# Altium schematic sheet 200_Ethernet.SchDoc: Ethernet
size A2; SheetNumber: 4; SheetTotal: 7
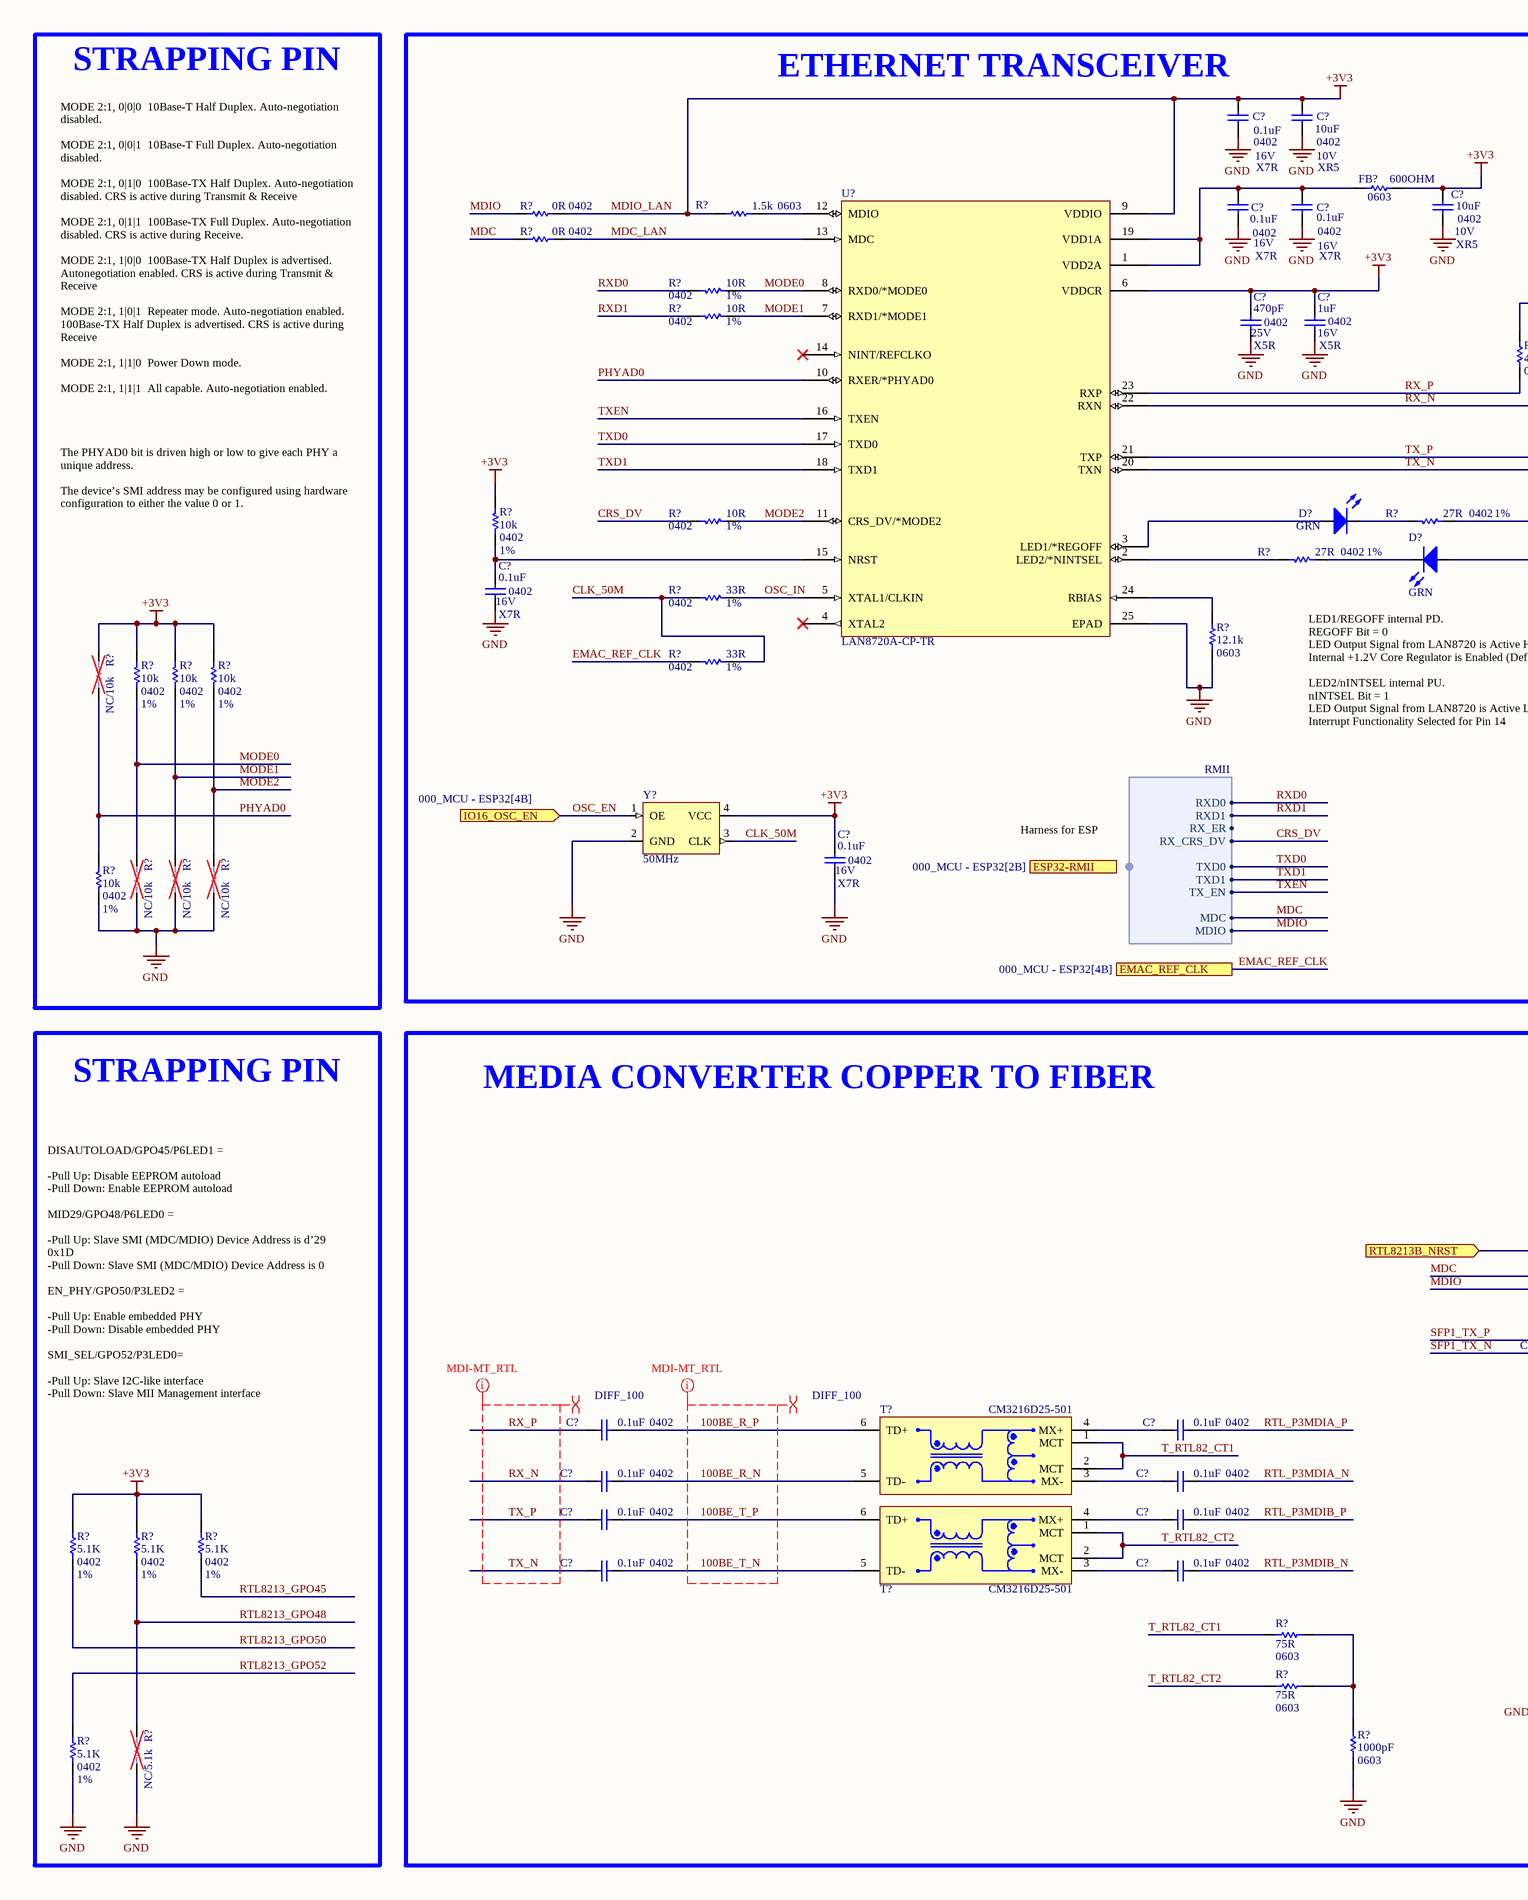
[diagram p0: 200_Ethernet.SchDoc, left]
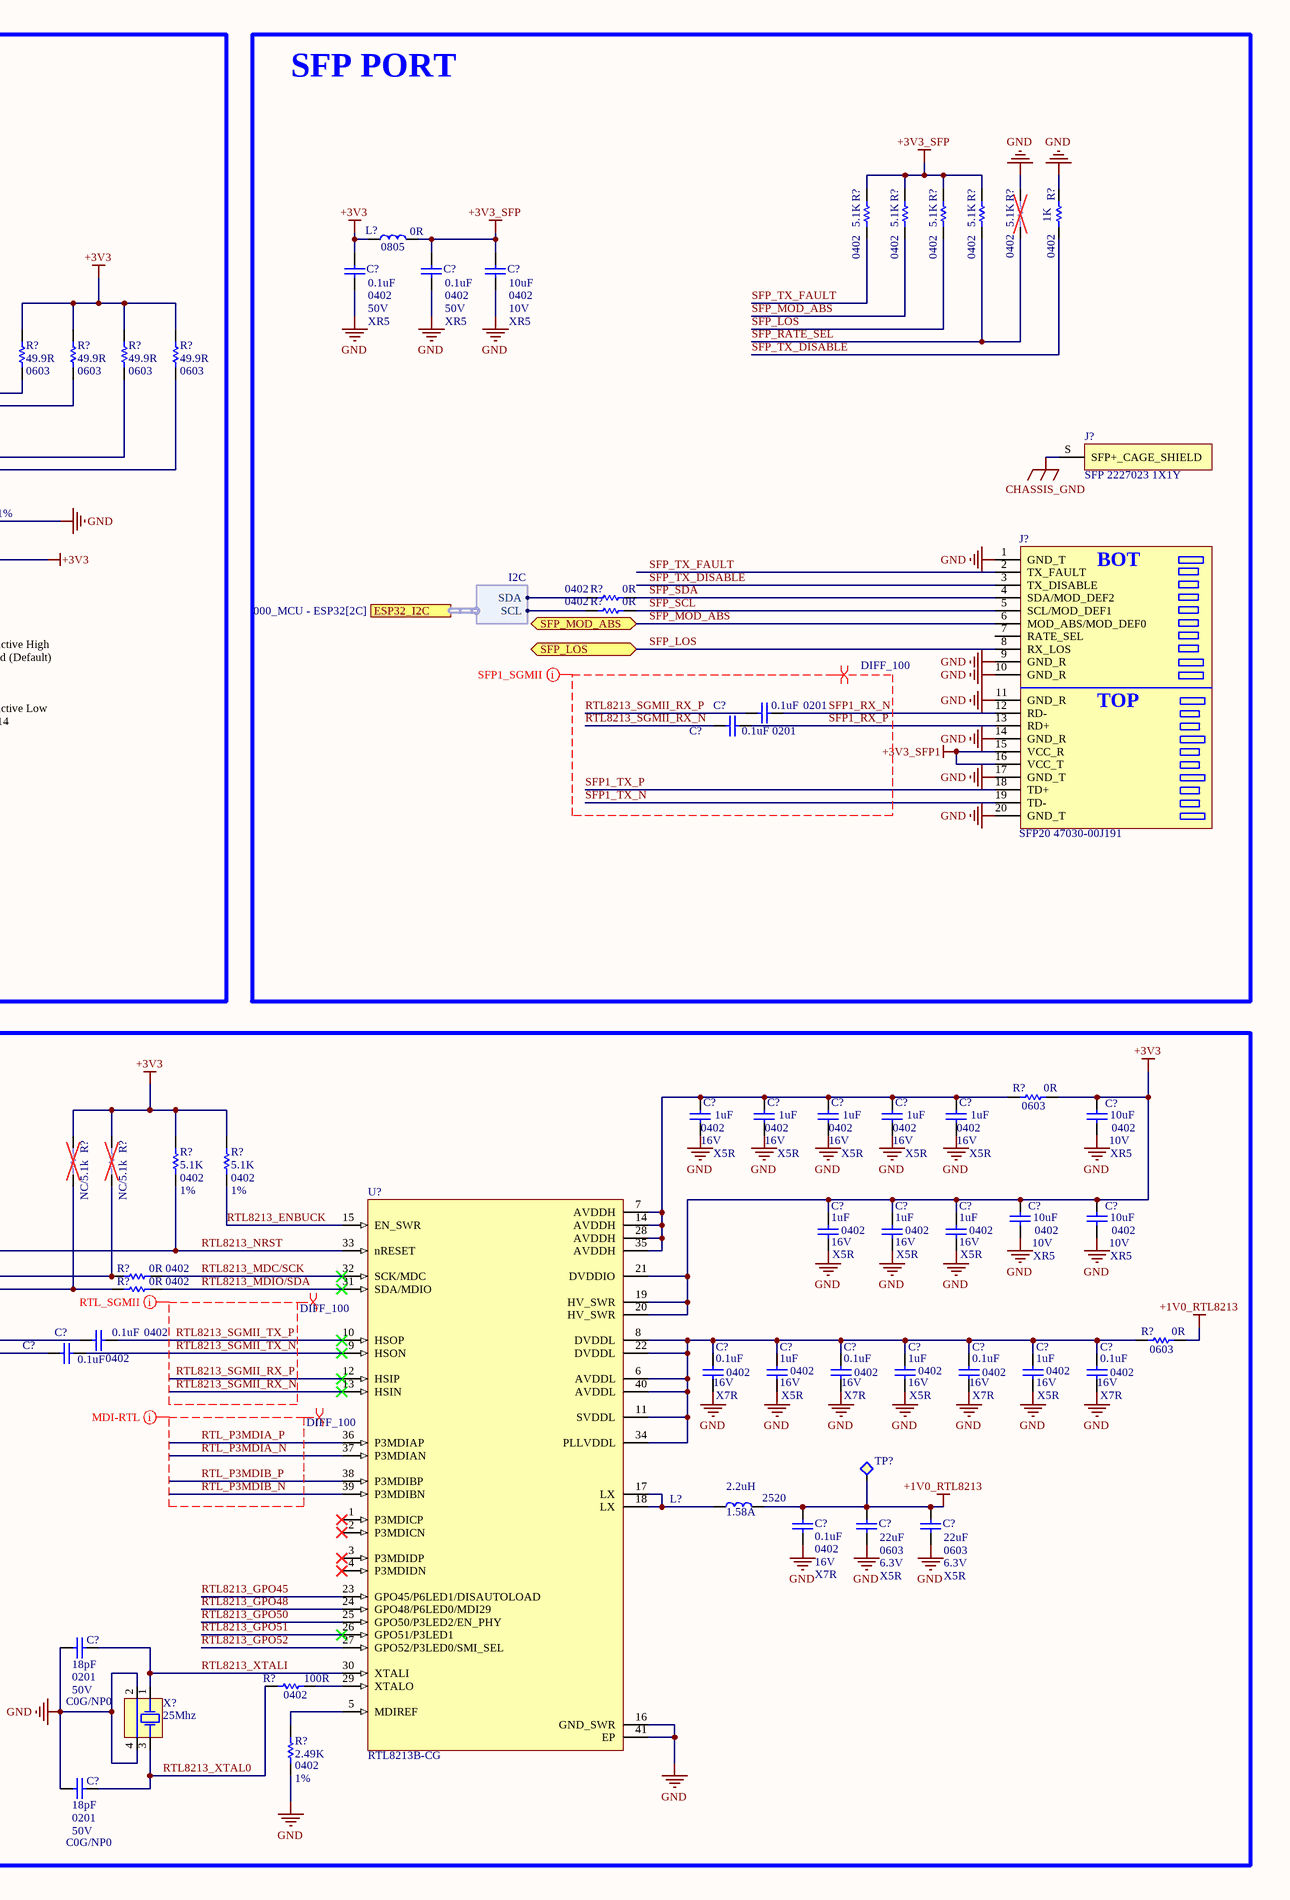
[diagram p1: 200_Ethernet.SchDoc, right]

## Parts
(Parts that share a designator on the sheet are numbered #1, #2 ... from top to bottom, then left to right.)
C?#1  0.1uF  PackageReference: 0402  Voltage: 16V  Temperature Coeficient: X7R  [CAPC1005X03N[0402]]
C?#2  10uF  PackageReference: 0402  Voltage: 10V  Temperature Coeficient: XR5  [CAPC1005X03N[0402]]
C?#3  0.1uF  PackageReference: 0402  Voltage: 16V  Temperature Coeficient: X7R  [CAPC1005X03N[0402]]
C?#4  0.1uF  PackageReference: 0402  Voltage: 16V  Temperature Coeficient: X7R  [CAPC1005X03N[0402]]
C?#5  10uF  PackageReference: 0402  Voltage: 10V  Temperature Coeficient: XR5  [CAPC1005X03N[0402]]
C?#6  0.1uF  PackageReference: 0402  Voltage: 50V  Temperature Coeficient: XR5  [CAPC1005X03N[0402]]
C?#7  0.1uF  PackageReference: 0402  Voltage: 50V  Temperature Coeficient: XR5  [CAPC1005X03N[0402]]
C?#8  10uF  PackageReference: 0402  Voltage: 10V  Temperature Coeficient: XR5  [CAPC1005X03N[0402]]
C?#9  470pF  PackageReference: 0402  Voltage: 25V  Temperature Coeficient: X5R  [CAPC1005X03N[0402]]
C?#10  1uF  PackageReference: 0402  Voltage: 16V  Temperature Coeficient: X5R  [CAPC1005X03N[0402]]
C?#11  0.1uF  PackageReference: 0402  Voltage: 16V  Temperature Coeficient: X7R  [CAPC1005X03N[0402]]
C?#12  0.1uF  PackageReference: 0201  [CAPC0603X04N[0201]]
C?#13  0.1uF  PackageReference: 0201  [CAPC0603X04N[0201]]
C?#14  0.1uF  PackageReference: 0402  Voltage: 16V  Temperature Coeficient: X7R  [CAPC1005X03N[0402]]
C?#15  1uF  PackageReference: 0402  Voltage: 16V  Temperature Coeficient: X5R  [CAPC1005X03N[0402]]
C?#16  1uF  PackageReference: 0402  Voltage: 16V  Temperature Coeficient: X5R  [CAPC1005X03N[0402]]
C?#17  1uF  PackageReference: 0402  Voltage: 16V  Temperature Coeficient: X5R  [CAPC1005X03N[0402]]
C?#18  1uF  PackageReference: 0402  Voltage: 16V  Temperature Coeficient: X5R  [CAPC1005X03N[0402]]
C?#19  1uF  PackageReference: 0402  Voltage: 16V  Temperature Coeficient: X5R  [CAPC1005X03N[0402]]
C?#20  10uF  PackageReference: 0402  Voltage: 10V  Temperature Coeficient: XR5  [CAPC1005X03N[0402]]
C?#21  10uF  PackageReference: 0402  Voltage: 10V  Temperature Coeficient: XR5  [CAPC1005X03N[0402]]
C?#22  10uF  PackageReference: 0402  Voltage: 10V  Temperature Coeficient: XR5  [CAPC1005X03N[0402]]
C?#23  1uF  PackageReference: 0402  Voltage: 16V  Temperature Coeficient: X5R  [CAPC1005X03N[0402]]
C?#24  1uF  PackageReference: 0402  Voltage: 16V  Temperature Coeficient: X5R  [CAPC1005X03N[0402]]
C?#25  1uF  PackageReference: 0402  Voltage: 16V  Temperature Coeficient: X5R  [CAPC1005X03N[0402]]
C?#26  0.1uF  PackageReference: 0402  [CAPC1005X03N[0402]]
C?#27  0.1uF  PackageReference: 0402  [CAPC1005X03N[0402]]
C?#28  0.1uF  PackageReference: 0402  Voltage: 16V  Temperature Coeficient: X7R  [CAPC1005X03N[0402]]
C?#29  1uF  PackageReference: 0402  Voltage: 16V  Temperature Coeficient: X5R  [CAPC1005X03N[0402]]
C?#30  0.1uF  PackageReference: 0402  Voltage: 16V  Temperature Coeficient: X7R  [CAPC1005X03N[0402]]
C?#31  1uF  PackageReference: 0402  Voltage: 16V  Temperature Coeficient: X5R  [CAPC1005X03N[0402]]
C?#32  0.1uF  PackageReference: 0402  Voltage: 16V  Temperature Coeficient: X7R  [CAPC1005X03N[0402]]
C?#33  1uF  PackageReference: 0402  Voltage: 16V  Temperature Coeficient: X5R  [CAPC1005X03N[0402]]
C?#34  0.1uF  PackageReference: 0402  Voltage: 16V  Temperature Coeficient: X7R  [CAPC1005X03N[0402]]
C?#35  0.1uF  PackageReference: 0402  [CAPC1005X03N[0402]]
C?#36  0.1uF  PackageReference: 0402  [CAPC1005X03N[0402]]
C?#37  0.1uF  PackageReference: 0402  [CAPC1005X03N[0402]]
C?#38  0.1uF  PackageReference: 0402  [CAPC1005X03N[0402]]
C?#39  0.1uF  PackageReference: 0402  [CAPC1005X03N[0402]]
C?#40  0.1uF  PackageReference: 0402  [CAPC1005X03N[0402]]
C?#41  0.1uF  PackageReference: 0402  Voltage: 16V  Temperature Coeficient: X7R  [CAPC1005X03N[0402]]
C?#42  22uF  PackageReference: 0603  Voltage: 6.3V  Temperature Coeficient: X5R  [CAPC1608X05N[0603]]
C?#43  22uF  PackageReference: 0603  Voltage: 6.3V  Temperature Coeficient: X5R  [CAPC1608X05N[0603]]
C?#44  0.1uF  PackageReference: 0402  [CAPC1005X03N[0402]]
C?#45  0.1uF  PackageReference: 0402  [CAPC1005X03N[0402]]
C?#46  18pF  PackageReference: 0201  Voltage: 50V  Temperature Coefficient: C0G/NP0  [CAPC0603X04N[0201]]
C?#47  18pF  PackageReference: 0201  Voltage: 50V  Temperature Coefficient: C0G/NP0  [CAPC0603X04N[0201]]
D?#1  GRN  [LED1608L(0603)]
D?#2  GRN  [LED1608L(0603)]
FB?  600OHM  PackageReference: 0603  [RESC1608X05N[0603]]
J?#1  SFP 2227023 1X1Y  [AMPHENOL_U77A16182001]
J?#2  SFP20 47030-00J191  [AMPHENOL_UE76A202000T]
L?#1  0R  PackageReference: 0805  [INDC2012X05N[0805]]
L?#2  2.2uH  PackageReference: 2520  Current: 1.58A  [INDP2520X10N[2510]-TDK]
R?#1  0R  PackageReference: 0402  [RESC1005X03N[0402]]
R?#2  1.5k  PackageReference: 0603  [RESC1608X05N[0603]]
R?#3  5.1K  PackageReference: 0402  [RESC1005X03N[0402]]
R?#4  5.1K  PackageReference: 0402  [RESC1005X03N[0402]]
R?#5  5.1K  PackageReference: 0402  [RESC1005X03N[0402]]
R?#6  5.1K  PackageReference: 0402  [RESC1005X03N[0402]]
R?#7  5.1K  PackageReference: 0402  [RESC1005X03N[0402]]
R?#8  1K  PackageReference: 0402  [RESC1005X03N[0402]]
R?#9  0R  PackageReference: 0402  [RESC1005X03N[0402]]
R?#10  10R  PackageReference: 0402  Tolerance: 1%  [RESC1005X03N[0402]]
R?#11  10R  PackageReference: 0402  Tolerance: 1%  [RESC1005X03N[0402]]
R?#12  49.9R  PackageReference: 0603  [RESC1608X05N[0603]]
R?#13  49.9R  PackageReference: 0603  [RESC1608X05N[0603]]
R?#14  49.9R  PackageReference: 0603  [RESC1608X05N[0603]]
R?#15  49.9R  PackageReference: 0603  [RESC1608X05N[0603]]
R?#16  10k  PackageReference: 0402  Tolerance: 1%  [RESC1005X03N[0402]]
R?#17  10R  PackageReference: 0402  Tolerance: 1%  [RESC1005X03N[0402]]
R?#18  27R  PackageReference: 0402  Tolerance: 1%  [RESC1005X03N[0402]]
R?#19  27R  PackageReference: 0402  Tolerance: 1%  [RESC1005X03N[0402]]
R?#20  33R  PackageReference: 0402  Tolerance: 1%  [RESC1005X03N[0402]]
R?#21  0R  PackageReference: 0402  [RESC1005X03N[0402]]
R?#22  0R  PackageReference: 0402  [RESC1005X03N[0402]]
R?#23  12.1k  PackageReference: 0603  [RESC1608X05N[0603]]
R?#24  33R  PackageReference: 0402  Tolerance: 1%  [RESC1005X03N[0402]]
R?#25  NC/10k  [RESC1005X03N[0402]]
R?#26  10k  PackageReference: 0402  Tolerance: 1%  [RESC1005X03N[0402]]
R?#27  10k  PackageReference: 0402  Tolerance: 1%  [RESC1005X03N[0402]]
R?#28  10k  PackageReference: 0402  Tolerance: 1%  [RESC1005X03N[0402]]
R?#29  10k  PackageReference: 0402  Tolerance: 1%  [RESC1005X03N[0402]]
R?#30  NC/10k  [RESC1005X03N[0402]]
R?#31  NC/10k  [RESC1005X03N[0402]]
R?#32  NC/10k  [RESC1005X03N[0402]]
R?#33  0R  PackageReference: 0603  [RESC1608X05N[0603]]
R?#34  NC/5.1k  [RESC1005X03N[0402]]
R?#35  NC/5.1k  [RESC1005X03N[0402]]
R?#36  5.1K  PackageReference: 0402  Tolerance: 1%  [RESC1005X03N[0402]]
R?#37  5.1K  PackageReference: 0402  Tolerance: 1%  [RESC1005X03N[0402]]
R?#38  0R  PackageReference: 0402  [RESC1005X03N[0402]]
R?#39  0R  PackageReference: 0402  [RESC1005X03N[0402]]
R?#40  0R  PackageReference: 0603  [RESC1608X05N[0603]]
R?#41  5.1K  PackageReference: 0402  Tolerance: 1%  [RESC1005X03N[0402]]
R?#42  5.1K  PackageReference: 0402  Tolerance: 1%  [RESC1005X03N[0402]]
R?#43  5.1K  PackageReference: 0402  Tolerance: 1%  [RESC1005X03N[0402]]
R?#44  75R  PackageReference: 0603  [RESC1608X05N[0603]]
R?#45  75R  PackageReference: 0603  [RESC1608X05N[0603]]
R?#46  100R  PackageReference: 0402  [RESC1005X03N[0402]]
R?#47  1000pF  PackageReference: 0603  [RESC1608X05N[0603]]
R?#48  5.1K  PackageReference: 0402  Tolerance: 1%  [RESC1005X03N[0402]]
R?#49  NC/5.1k  [RESC1005X03N[0402]]
R?#50  2.49K  PackageReference: 0402  Tolerance: 1%  [RESC1005X03N[0402]]
T?#1  CM3216D25-501  [CNDTek_CM3216D25-501]
T?#2  CM3216D25-501  [CNDTek_CM3216D25-501]
TP?  (no value)  [TestPoint-1mm]  (no BOM)
U?#1  LAN8720A-CP-TR  [QFN50P400X400X90-24D250N]
U?#2  RTL8213B-CG  [QFN40P500X500X90_HS-41N-REALTEK]
X?  25Mhz  [3.2X2.5MM]
Y?  50MHz  [SMD2520-4P]

## Blocks framed on the sheet
STRAPPING PIN: R?#25-R?#32
ETHERNET TRANSCEIVER: C?#1-C?#5 C?#9-C?#11 C?#14 D?#1 D?#2 FB? R?#1 R?#2 R?#9-R?#20 R?#23 R?#24 U?#1 Y?
SFP PORT: C?#6-C?#8 C?#12 C?#13 J?#1 J?#2 L?#1 R?#3-R?#8 R?#21 R?#22
STRAPPING PIN: R?#41-R?#43 R?#48 R?#49
MEDIA CONVERTER COPPER TO FIBER: C?#15-C?#47 L?#2 R?#33-R?#40 R?#44-R?#47 R?#50 T?#1 T?#2 TP? U?#2 X?

## Ports
EMAC_REF_CLK (see 000_MCU - ESP32[4B]), ESP32-RMII (harness RMII, see 000_MCU - ESP32[2B]), ESP32_I2C (harness I2C, see 000_MCU - ESP32[2C]), IO16_OSC_EN (in, see 000_MCU - ESP32[4B]), RTL8213B_NRST (in), SFP_LOS (bidir), SFP_MOD_ABS (bidir)

## Harnesses
RMII: TXD0, TXD1, TX_EN, MDC, MDIO, RXD0, RXD1, RX_ER, RX_CRS_DV
I2C: SDA, SCL

## Nets
+1V0_RTL8213: C?#41.2 C?#42.2 C?#43.2 L?#2.2 R?#40.2 TP?.1(TEST)
+3V3_SFP: C?#7.2 C?#8.2 L?#1.2 R?#3.1 R?#4.1 R?#5.1 R?#6.1
+3V3_SFP1: J?#2.15(VCC_R) J?#2.16(VCC_T)
CHASSIS_GND: J?#1.S(SFP+_CAGE_SHIELD)
GND: C?#1.1 C?#2.1 C?#3.1 C?#4.1 C?#5.1 C?#6.1 C?#7.1 C?#8.1 C?#9.1 C?#10.1 C?#11.1 C?#14.1 C?#15.1 C?#16.1 C?#17.1 C?#18.1 C?#19.1 C?#20.1 C?#21.1 C?#22.1 C?#23.1 C?#24.1 C?#25.1 C?#28.1 C?#29.1 C?#30.1 C?#31.1 C?#32.1 C?#33.1 C?#34.1 C?#41.1 C?#42.1 C?#43.1 C?#46.2 C?#47.2 J?#2.1(GND_T) J?#2.9(GND_R) J?#2.10(GND_R) J?#2.11(GND_R) J?#2.14(GND_R) J?#2.17(GND_T) J?#2.20(GND_T) R?#7.2 R?#8.1 R?#18.1 R?#23.1 R?#29.1 R?#30.1 R?#31.1 R?#32.1 R?#47.2 R?#48.2 R?#49.1 R?#50.1 U?#1.25(EPAD) U?#2.16(GND_SWR) U?#2.41(EP) X?.2(COM) X?.4(COM) Y?.2(GND)
MDIO_LAN: C?#1.2 C?#2.2 C?#5.2 C?#6.2 C?#9.2 C?#10.2 C?#14.2 C?#20.2 C?#21.2 C?#22.2 C?#23.2 C?#24.2 C?#25.2 D?#2.A FB?.2 L?#1.1 R?#1.1 R?#2.2 R?#12.2 R?#13.2 R?#14.2 R?#15.2 R?#16.2 R?#25.2 R?#26.2 R?#27.2 R?#28.2 R?#33.2 R?#34.2 R?#35.2 R?#36.1 R?#37.1 R?#41.1 R?#42.1 R?#43.1 U?#1.6(VDDCR) U?#1.9(VDDIO) U?#2.19(HV_SWR) U?#2.20(HV_SWR) U?#2.21(DVDDIO) Y?.4(VCC)  [also labelled +3V3]
100BE_R_N: C?#37.1 T?#1.5(TD-)
100BE_R_P: C?#35.1 T?#1.6(TD+)
100BE_T_N: C?#44.1 T?#2.5(TD-)
100BE_T_P: C?#39.1 T?#2.6(TD+)
CLK_50M: R?#20.2 R?#24.1 Y?.3(CLK)
CRS_DV: R?#17.2 ; harness RMII.RX_CRS_DV
EMAC_REF_CLK: R?#24.2 ; port EMAC_REF_CLK
MDC: R?#9.2 R?#35.1 R?#38.2 ; harness RMII.MDC
MDC_LAN: R?#9.1 U?#1.13(MDC)
MDIO: R?#1.2 R?#34.1 R?#39.2 ; harness RMII.MDIO
MODE0: R?#10.1 R?#26.1 R?#30.2 U?#1.8(RXD0/*MODE0)
MODE1: R?#11.1 R?#27.1 R?#31.2 U?#1.7(RXD1/*MODE1)
MODE2: R?#17.1 R?#28.1 R?#32.2 U?#1.11(CRS_DV/*MODE2)
OSC_EN: Y?.1(OE) ; port IO16_OSC_EN
OSC_IN: R?#20.1 U?#1.5(XTAL1/CLKIN)
PHYAD0: R?#25.1 R?#29.2 U?#1.10(RXER/*PHYAD0)
RTL8213_ENBUCK: R?#37.2 U?#2.15(EN_SWR)
RTL8213_GPO45: R?#43.2 U?#2.23(GPO45/P6LED1/DISAUTOLOAD)
RTL8213_GPO48: R?#42.2 R?#49.2 U?#2.24(GPO48/P6LED0/MDI29)
RTL8213_GPO50: R?#41.2 U?#2.25(GPO50/P3LED2/EN_PHY)
RTL8213_GPO51: U?#2.26(GPO51/P3LED1)
RTL8213_GPO52: R?#48.1 U?#2.27(GPO52/P3LED0/SMI_SEL)
RTL8213_MDC/SCK: R?#38.1 U?#2.32(SCK/MDC)
RTL8213_MDIO/SDA: R?#39.1 U?#2.31(SDA/MDIO)
RTL8213_NRST: R?#36.2 U?#2.33(nRESET) ; port RTL8213B_NRST
RTL8213_SGMII_RX_N: C?#13.2 U?#2.13(HSIN)
RTL8213_SGMII_RX_P: C?#12.2 U?#2.12(HSIP)
RTL8213_SGMII_TX_N: C?#27.1 U?#2.9(HSON)
RTL8213_SGMII_TX_P: C?#26.1 U?#2.10(HSOP)
RTL8213_XTAL0: C?#47.1 R?#46.2 X?.3(OSC2)
RTL8213_XTALI: C?#46.1 U?#2.30(XTALI) X?.1(OSC1)
RTL_P3MDIA_N: C?#38.1 U?#2.37(P3MDIAN)
RTL_P3MDIA_P: C?#36.1 U?#2.36(P3MDIAP)
RTL_P3MDIB_N: C?#45.1 U?#2.39(P3MDIBN)
RTL_P3MDIB_P: C?#40.1 U?#2.38(P3MDIBP)
RX_N: C?#37.2 R?#13.1 U?#1.22(RXN)
RX_P: C?#35.2 R?#12.1 U?#1.23(RXP)
RXD0: R?#10.2 ; harness RMII.RXD0
RXD1: R?#11.2 ; harness RMII.RXD1
SFP1_RX_N: C?#12.1 J?#2.12(RD-)
SFP1_RX_P: C?#13.1 J?#2.13(RD+)
SFP1_TX_N: C?#27.2 J?#2.19(TD-)
SFP1_TX_P: C?#26.2 J?#2.18(TD+)
SFP_LOS: J?#2.8(RX_LOS) R?#5.2 ; port SFP_LOS
SFP_MOD_ABS: J?#2.6(MOD_ABS/MOD_DEF0) R?#4.2 ; port SFP_MOD_ABS
SFP_RATE_SEL: R?#6.2 R?#7.1
SFP_SCL: J?#2.5(SCL/MOD_DEF1) R?#22.1
SFP_SDA: J?#2.4(SDA/MOD_DEF2) R?#21.1
SFP_TX_DISABLE: J?#2.3(TX_DISABLE) R?#8.2
SFP_TX_FAULT: J?#2.2(TX_FAULT) R?#3.2
T_RTL82_CT1: R?#44.1 T?#1.1(MCT) T?#1.2(MCT)
T_RTL82_CT2: R?#45.1 T?#2.1(MCT) T?#2.2(MCT)
TX_N: C?#44.2 R?#15.1 U?#1.20(TXN)
TX_P: C?#39.2 R?#14.1 U?#1.21(TXP)
TXD0: U?#1.17(TXD0) ; harness RMII.TXD0
TXD1: U?#1.18(TXD1) ; harness RMII.TXD1
TXEN: U?#1.16(TXEN) ; harness RMII.TX_EN
NetC?#3_2: C?#3.2 C?#4.2 FB?.1 U?#1.1(VDD2A) U?#1.19(VDD1A)
NetC?#11_2: C?#11.2 R?#16.1 U?#1.15(NRST)
NetC?#15_2: C?#15.2 C?#16.2 C?#17.2 C?#18.2 C?#19.2 R?#33.1 U?#2.7(AVDDH) U?#2.14(AVDDH) U?#2.28(AVDDH) U?#2.35(AVDDH)
NetC?#28_2: C?#28.2 C?#29.2 C?#30.2 C?#31.2 C?#32.2 C?#33.2 C?#34.2 R?#40.1 U?#2.6(AVDDL) U?#2.8(DVDDL) U?#2.11(SVDDL) U?#2.22(DVDDL) U?#2.34(PLLVDDL) U?#2.40(AVDDL)
NetC?#36_2: C?#36.2 T?#1.4(MX+)
NetC?#38_2: C?#38.2 T?#1.3(MX-)
NetC?#40_2: C?#40.2 T?#2.4(MX+)
NetC?#45_2: C?#45.2 T?#2.3(MX-)
NetD?#1_A: D?#1.A U?#1.3(LED1/*REGOFF)
NetD?#1_K: D?#1.K R?#18.2
NetD?#2_K: D?#2.K R?#19.1
NetL?#2_1: L?#2.1 U?#2.17(LX) U?#2.18(LX)
NetR?#2_1: R?#2.1 U?#1.12(MDIO)
NetR?#19_2: R?#19.2 U?#1.2(LED2/*NINTSEL)
NetR?#21_2: R?#21.2 ; port ESP32_I2C.SDA
NetR?#22_2: R?#22.2 ; port ESP32_I2C.SCL
NetR?#23_2: R?#23.2 U?#1.24(RBIAS)
NetR?#44_2: R?#44.2 R?#45.2 R?#47.1
NetR?#46_1: R?#46.1 U?#2.29(XTALO)
NetR?#50_2: R?#50.2 U?#2.5(MDIREF)

Not connected (* = marked no-connect by the designer): J?#2 7(RATE_SEL); U?#1 4(XTAL2)* 14(NINT/REFCLKO)*; U?#2 1(P3MDICP)* 2(P3MDICN)* 3(P3MDIDP)* 4(P3MDIDN)*

## Layout directives
differential pair; differential pair class DIFF_100: 100BE_R_N, 100BE_R_P, 100BE_T_N, 100BE_T_P, RTL8213_SGMII_RX_N, RTL8213_SGMII_RX_P, RTL8213_SGMII_TX_N, RTL8213_SGMII_TX_P, RTL_P3MDIA_N, RTL_P3MDIA_P, RTL_P3MDIB_N, RTL_P3MDIB_P, RX_N, RX_P, SFP1_RX_N, SFP1_RX_P, SFP1_TX_N, SFP1_TX_P, TX_N, TX_P
net class RTL_SGMII: RTL8213_SGMII_RX_N, RTL8213_SGMII_RX_P, RTL8213_SGMII_TX_N, RTL8213_SGMII_TX_P
net class MDI-MT_RTL: 100BE_R_N, 100BE_R_P, 100BE_T_N, 100BE_T_P, RX_N, RX_P, TX_N, TX_P
net class MDI-RTL: RTL_P3MDIA_N, RTL_P3MDIA_P, RTL_P3MDIB_N, RTL_P3MDIB_P
net class SFP1_SGMII: RTL8213_SGMII_RX_N, RTL8213_SGMII_RX_P, SFP1_RX_N, SFP1_RX_P, SFP1_TX_N, SFP1_TX_P

## Notes on the sheet
- MODE 2:1, 0|0|0  10Base-T Half Duplex. Auto-negotiation disabled.
  MODE 2:1, 0|0|1  10Base-T Full Duplex. Auto-negotiation disabled.
  MODE 2:1, 0|1|0  100Base-TX Half Duplex. Auto-negotiation disabled. CRS is active during Transmit & Receive
  MODE 2:1, 0|1|1  100Base-TX Full Duplex. Auto-negotiation disabled. CRS is active during Receive.
  MODE 2:1, 1|0|0  100Base-TX Half Duplex is advertised. Autonegotiation enabled. CRS is active during Transmit & Receive
  MODE 2:1, 1|0|1  Repeater mode. Auto-negotiation enabled. 100Base-TX Half Duplex is advertised. CRS is active during Receive
  MODE 2:1, 1|1|0  Power Down mode.
  MODE 2:1, 1|1|1  All capable. Auto-negotiation enabled.
- The PHYAD0 bit is driven high or low to give each PHY a unique address.
  The device’s SMI address may be configured using hardware configuration to either the value 0 or 1.
- LED1/REGOFF internal PD.
  REGOFF Bit = 0
  LED Output Signal from LAN8720 is Active High
  Internal +1.2V Core Regulator is Enabled (Default)
  LED2/nINTSEL internal PU.
  nINTSEL Bit = 1
  LED Output Signal from LAN8720 is Active Low
  Interrupt Functionality Selected for Pin 14
- Harness for ESP
- DISAUTOLOAD/GPO45/P6LED1 =
  -Pull Up: Disable EEPROM autoload
  -Pull Down: Enable EEPROM autoload
  MID29/GPO48/P6LED0 =
  -Pull Up: Slave SMI (MDC/MDIO) Device Address is d’29 0x1D
  -Pull Down: Slave SMI (MDC/MDIO) Device Address is 0
  EN_PHY/GPO50/P3LED2 =
  -Pull Up: Enable embedded PHY
  -Pull Down: Disable embedded PHY
  SMI_SEL/GPO52/P3LED0=
  -Pull Up: Slave I2C-like interface
  -Pull Down: Slave MII Management interface
- Title:
- Date:
- Project:
- File:
- Size:
- A2
- Drawn by:
- Revision:
- www.somosinternet.com <http://www.somosinternet.com>
- (in symbol SFP20 47030-00J191) BOT; TOP

## Library data of the parts
C?#1-C?#8 C?#11 C?#14 C?#20-C?#22 C?#28 C?#30 C?#32 C?#34 C?#41-C?#43 C?#46 C?#47 = CAP-generic: Chip Ceramic Capacitor SMD; Populated: Yes; Manuf1: *; Manuf2: *; Manuf1Partnumber: *; Manuf2Partnumber: *; ClassName: *; ROHS: Yes; LifeCycle: Checked; HelpURL: *
  C?#1 C?#3 C?#4 C?#11 C?#14 C?#28 C?#30 C?#32 C?#34 C?#41: Value: 0.1uF; Supplier 1: Digikey; Supplier Part Number 1: 311-3342-1-ND
  C?#2 C?#5 C?#20-C?#22: Value: 10uF; Supplier 1: DigiKey; Supplier Part Number 1: 490-GRM155R61A106ME11DCT-ND
  C?#6 C?#7: Value: 0.1uF; LCSC: C2888326; ComponentLink1Description: LCSC Link; ComponentLink1URL: https://www.lcsc.com/product-detail/C2888326.html?s_z=n_q_t_0.1uF%25200402&spm=wm.fly.bg.1.xh___wm.ssy.tc.0.tz&lcsc_vid=EgJfAwZfQFAKX11URFdeUQJWEVdaBVZUTgRWV10EQ1MxVlNeRFBaUFRXTlVaVDsOAxUeFF5JWBYZEEoKFBINSQcJGk4NBhADEA4cHktXRlVcSQwSGg0%3D
  C?#8: Value: 10uF; LCSC: C7472949; ComponentLink1Description: LCSC Link; ComponentLink1URL: https://www.lcsc.com/product-detail/C7472949.html?s_z=n_q_t_10uF%25200402&spm=wm.fly.bg.2.xh___wm.ssy.tc.0.tz&lcsc_vid=EgJfAwZfQFAKX11URFdeUQJWEVdaBVZUTgRWV10EQ1MxVlNeRFBaUVxWRFBfUTsOAxUeFF5JWBYZEEoKFBINSQcJGk4eFQsCAgIaSgADAwAHC0slQFVZVV1ST08GEwkK
  C?#42 C?#43: Value: 22uF; Supplier 1: Digikey; Supplier Part Number 1: 490-7611-1-ND
  C?#46 C?#47: Value: 18pF; Supplier 1: DigiKey; Supplier Part Number 1: 490-6117-1-ND
C?#9 = CAP-generic: Chip Ceramic Capacitor SMD; Manuf1: Samsung Electro-Mechanics; Manuf1Partnumber: CL05A474KA5NNNC; Populated: Yes; Value: 470pF; Manuf2: *; Manuf2Partnumber: *; ClassName: *; ROHS: Yes; LifeCycle: Checked; HelpURL: *; Supplier 1: LCSC; Supplier Part Number 1: C92361
C?#10 C?#15-C?#19 C?#23-C?#25 C?#29 C?#31 C?#33 = CAP-generic: Chip Ceramic Capacitor SMD; Manuf1: Samsung Electro-Mechanics; Manuf1Partnumber: CL05A105KO5NNNC; Populated: Yes; Value: 1uF; Manuf2: *; Manuf2Partnumber: *; ClassName: *; ROHS: Yes; LifeCycle: Checked; HelpURL: *; Supplier 1: LCSC; Supplier Part Number 1: C29266
C?#12 C?#13 = CAP-generic: Chip Ceramic Capacitor SMD; Populated: Yes; Voltage: 10V; Value: 0.1uF; Manuf1: *; Manuf2: *; Manuf1Partnumber: *; Manuf2Partnumber: *; ClassName: *; ROHS: Yes; LifeCycle: Checked; HelpURL: *; Code_JEDEC: X5R; Supplier 1: DigiKey; Supplier Part Number 1: 490-14571-1-ND
C?#26 C?#27 C?#35-C?#40 C?#44 C?#45 = CAP-generic: Chip Ceramic Capacitor SMD; Populated: Yes; Voltage: 16V; Temperature Coeficient: X7R; Value: 0.1uF; Manuf1: *; Manuf2: *; Manuf1Partnumber: *; Manuf2Partnumber: *; ClassName: *; ROHS: Yes; LifeCycle: Checked; HelpURL: *; Supplier 1: Digikey; Supplier Part Number 1: 311-3342-1-ND
D?#1 D?#2 = LED: LED GREEN WATER CLEAR 0603 SMD; Manufacturer: HONGLITRONIC; Manufacturer Part Number: PSC-1608U52GC-G4; Value: GRN; Supplier Part Number 1: C22371297; ComponentLink1Description: LCSC; ComponentLink1URL: https://www.lcsc.com/product-detail/C22371297.html?s_z=n_q_led%2520green%25200603
FB? = RES-generic: Chip Resistor SMD; Manuf1: TDK; Manuf1Partnumber: MPZ1608S601ATA00; Populated: Yes; Value: 600OHM; Supplier 1: LCSC; Supplier Part Number 1: C107335
J?#1 = U77A16182001: Connector Accessories SFP Cage Right Angle Copper Alloy Nickel Tray; Manufacturer: Amphenol Communications Solutions; Current Rating: 500mA; Gender: Female; Insulation Resistance: 1GΩ; Number of Ports: 1; Voltage Rating: 3.3V; Supplier: DigiKey; Supplier Part Number: 664-U77A16182001-ND; Manufacturer Part Number: U77A16182001; RoHS: Compliant; Category: Connectors; Stock: 11893; Pricing: 1=2,72, 10=2,307, 25=2,1624, 50=2,059, 100=1,9607, 250=1,83784, 500=1,7501, 1000=1,66661, 2500=1,56234 (USD); Connector Type: SFP; Contact Plating: Nickel; Depth: 48.98mm; Features: Shielded; Housing Material: Copper; Lead Free: Lead Free; Length: 16.3mm; Lifecycle Status: Production; Max Operating Temperature: 85°C; Min Operating Temperature: -40°C; Mounting Technology: Through Hole; Orientation: Right Angle; REACH SVHC: Unknown; Termination: Press-Fit; ComponentLink1URL: https://datasheet.octopart.com:443/U77A16182001-Amphenol-Communications-Solutions-datasheet-116638668.pdf?src-supplier=Electro+Sonic; ComponentLink1Description: https://datasheet.octopart.com:443/U77A16182001-Amphenol-Communications-Solutions-datasheet-116638668.pdf?src-supplier=Electro+Sonic; ComponentLink2URL: https://datasheet.octopart.com:443/U77A16182001-Amphenol-Communications-Solutions-datasheet-8501042.pdf?src-supplier=Farnell; ComponentLink2Description: https://datasheet.octopart.com:443/U77A16182001-Amphenol-Communications-Solutions-datasheet-8501042.pdf?src-supplier=Farnell; LCSC: C42931382
J?#2 = SFP20 47030-00J191: CONN SFP  RCPT 20POS SLD R/A SMD; Manufacturer: CND-Tek; LCSC: C50159076; Manufacturer Part Number: SFP20 47030-00J191; ComponentLink1Description: LCSC Link; ComponentLink1URL: https://www.lcsc.com/product-detail/C50159076.html?s_z=n_SFP
L?#1 L?#2 = IND-generic: Chip Inductor SMD; Populated: Yes; Manuf1: *; Manuf2: *; Manuf1Partnumber: *; Manuf2Partnumber: *; ClassName: *; ROHS: Yes; LifeCycle: Checked; HelpURL: *; Supplier 1: DigiKey
  L?#1: Value: 0R; Current: *; Supplier Part Number 1: RMCF0603ZT0R00CT-ND
  L?#2: Value: 2.2uH; Supplier Part Number 1: 445-172972-1-ND
R?#1 R?#3-R?#6 R?#8 R?#9 R?#21 R?#22 R?#38 R?#39 R?#46 = RES-generic: Chip Resistor SMD; Populated: Yes; Tolerance: 1%; Manuf1: *; Manuf2: *; Manuf1Partnumber: *; Manuf2Partnumber: *; ClassName: *; ROHS: Yes; LifeCycle: Checked; HelpURL: *; Power: *
  R?#1 R?#9 R?#21 R?#22 R?#38 R?#39: Value: 0R; Supplier 1: DigiKey; Supplier Part Number 1: 311-0.0JRCT-ND
  R?#3-R?#6: Value: 5.1K; Supplier 1: DigiKey; Supplier Part Number 1: 311-5.10KLRCT-ND
  R?#8: Value: 1K; Supplier 1: Digikey; Supplier Part Number 1: P1.00KLDKR-ND
  R?#46: Value: 100R; Supplier 1: DigiKey; Supplier Part Number 1: 311-100LRCT-ND
R?#2 = RES-generic: Chip Resistor SMD; Manuf1: FOJAN; Manuf1Partnumber: FRC0603F1501TS; Populated: Yes; Value: 1.5k; Manuf2: *; Manuf2Partnumber: *; ClassName: *; ROHS: Yes; LifeCycle: Checked; HelpURL: *; Power: *; Tolerance: *; Supplier 1: LCSC; Supplier Part Number 1: C2930050
R?#7 R?#25 R?#30-R?#32 R?#34 R?#35 R?#49 = DNP-RES: (DNP) "Do Not Populate" Chip Resistor SMD; Populated: No; Manuf1: *; Manuf2: *; Manuf1Partnumber: *; Manuf2Partnumber: *; ClassName: *; ROHS: Yes; LifeCycle: Checked; HelpURL: *; Power: *; Tolerance: *
  R?#7: Value: 5.1K
  R?#25 R?#30-R?#32: Value: NC/10k
  R?#34 R?#35 R?#49: Value: NC/5.1k
R?#10 R?#11 R?#17 = RES-generic: Chip Resistor SMD; Manuf1: FOJAN; Manuf1Partnumber: FRC0402J100 TS; Populated: Yes; Value: 10R; Manuf2: *; Manuf2Partnumber: *; ClassName: *; ROHS: Yes; LifeCycle: Checked; HelpURL: *; Power: *; Supplier 1: LCSC; Supplier Part Number 1: C2906886
R?#12-R?#15 = RES-generic: Chip Resistor SMD; Manuf1: FOJAN; Manuf1Partnumber: FRC0603F49R9TS; Populated: Yes; Value: 49.9R; Manuf2: *; Manuf2Partnumber: *; ClassName: *; ROHS: Yes; LifeCycle: Checked; HelpURL: *; Power: *; Tolerance: *; Supplier 1: LCSC; Supplier Part Number 1: C2930110
R?#16 R?#26-R?#29 R?#33 R?#36 R?#37 R?#40-R?#45 R?#47 R?#48 R?#50 = RES-generic: Chip Resistor SMD; Populated: Yes; Manuf1: *; Manuf2: *; Manuf1Partnumber: *; Manuf2Partnumber: *; ClassName: *; ROHS: Yes; LifeCycle: Checked; HelpURL: *; Power: *
  R?#16 R?#26-R?#29: Value: 10k; Supplier 1: Digikey; Supplier Part Number 1: 1276-3431-1-ND
  R?#33 R?#40: Value: 0R; Tolerance: *; Supplier 1: Digi-Key; Supplier Part Number 1: RMCF0603ZT0R00CT-ND
  R?#36 R?#37 R?#41-R?#43 R?#48: Value: 5.1K; Supplier 1: DigiKey; Supplier Part Number 1: 311-5.10KLRCT-ND
  R?#44 R?#45: Value: 75R; Tolerance: *; Supplier 1: DigiKey; Supplier Part Number 1: YAG1306CT-ND
  R?#47: Value: 1000pF; Tolerance: *; Supplier 1: DigiKey; Supplier Part Number 1: 399-C0603C102MBRACTUCT-ND
  R?#50: Value: 2.49K; Supplier 1: DigiKey; Supplier Part Number 1: YAG3468CT-ND
R?#18 R?#19 = RES-generic: Chip Resistor SMD; Manuf1: FOJAN; Manuf1Partnumber: FRC0402F2700TS; Populated: Yes; Value: 27R; Manuf2: *; Manuf2Partnumber: *; ClassName: *; ROHS: Yes; LifeCycle: Checked; HelpURL: *; Power: *; Supplier 1: LCSC; Supplier Part Number 1: C2909342
R?#20 R?#24 = RES-generic: Chip Resistor SMD; Manuf1: FOJAN; Manuf1Partnumber: FRC0402J330 TS; Populated: Yes; Value: 33R; Manuf2: *; Manuf2Partnumber: *; ClassName: *; ROHS: Yes; LifeCycle: Checked; HelpURL: *; Power: *; Supplier 1: LCSC; Supplier Part Number 1: C2906931
R?#23 = RES-generic: Chip Resistor SMD; Manuf1: FOJAN; Manuf1Partnumber: FRC0603F1212TS; Populated: Yes; Value: 12.1k; Manuf2: *; Manuf2Partnumber: *; ClassName: *; ROHS: Yes; LifeCycle: Checked; HelpURL: *; Power: *; Tolerance: *; Supplier 1: LCSC; Supplier Part Number 1: C2930059
T?#1 T?#2 = CM3216D25-501: CHIP LAN FILTER, Meets IEEE 802.3 & ANSI X3.263 Standards, Designed For 2.5G BASE - T Applications, Surface Mount Type
TP? = TestPoint: Test Point
U?#1 = LAN8720A-CP-TR: Small Footprint RMII 10/100 Ethernet Transceiver with HP Auto-MDiX Support; Manufacturer: Microchip; Supplier 1: LCSC; Manufacturer PartNumber: LAN8720A-CP-TR; Supplier Part Number 1: C45223; ComponentLink1Description: LCSC; ComponentLink1URL: https://www.lcsc.com/product-detail/C45223.html?s_z=n_q_lan8720
U?#2 = RTL8213B-CG: 10/100/1000M Copper to 100Base-FX/1000Base-X Fiber Media Converter; Manufacturer: Realtek; Manufacturer Part Numebr: RTL8213B-CG; LCSC: C2766076; ComponentLink1Description: LCSC Link; ComponentLink1URL: https://www.lcsc.com/product-detail/C2766076.html
X? = XTAL-4: Generic Crystal 4SMD; Populated: Yes; ROHS: Yes; Value: 25Mhz; Supplier 1: DigiKey; Supplier Part Number 1: 2151-RH100-25.000-16-F-3030-EXT-TRCT-ND
Y? = SX2M50.000M20F30TNN: XTAL OSC 50MHz CMOS SMD; Manufacturer: SCTF; Manufacturer Part Number: SX2M50.000M20F30TNN; Supplier Part Number 1: C2901606; Supplier 1: LCSC; ComponentLink1Description: LCSC; ComponentLink1URL: https://www.lcsc.com/product-detail/C2901606.html?s_z=s_c_Oscillators